# EAGLE design SparkFun_Mic-Preamp-v12 (EAGLE 7.2.0)
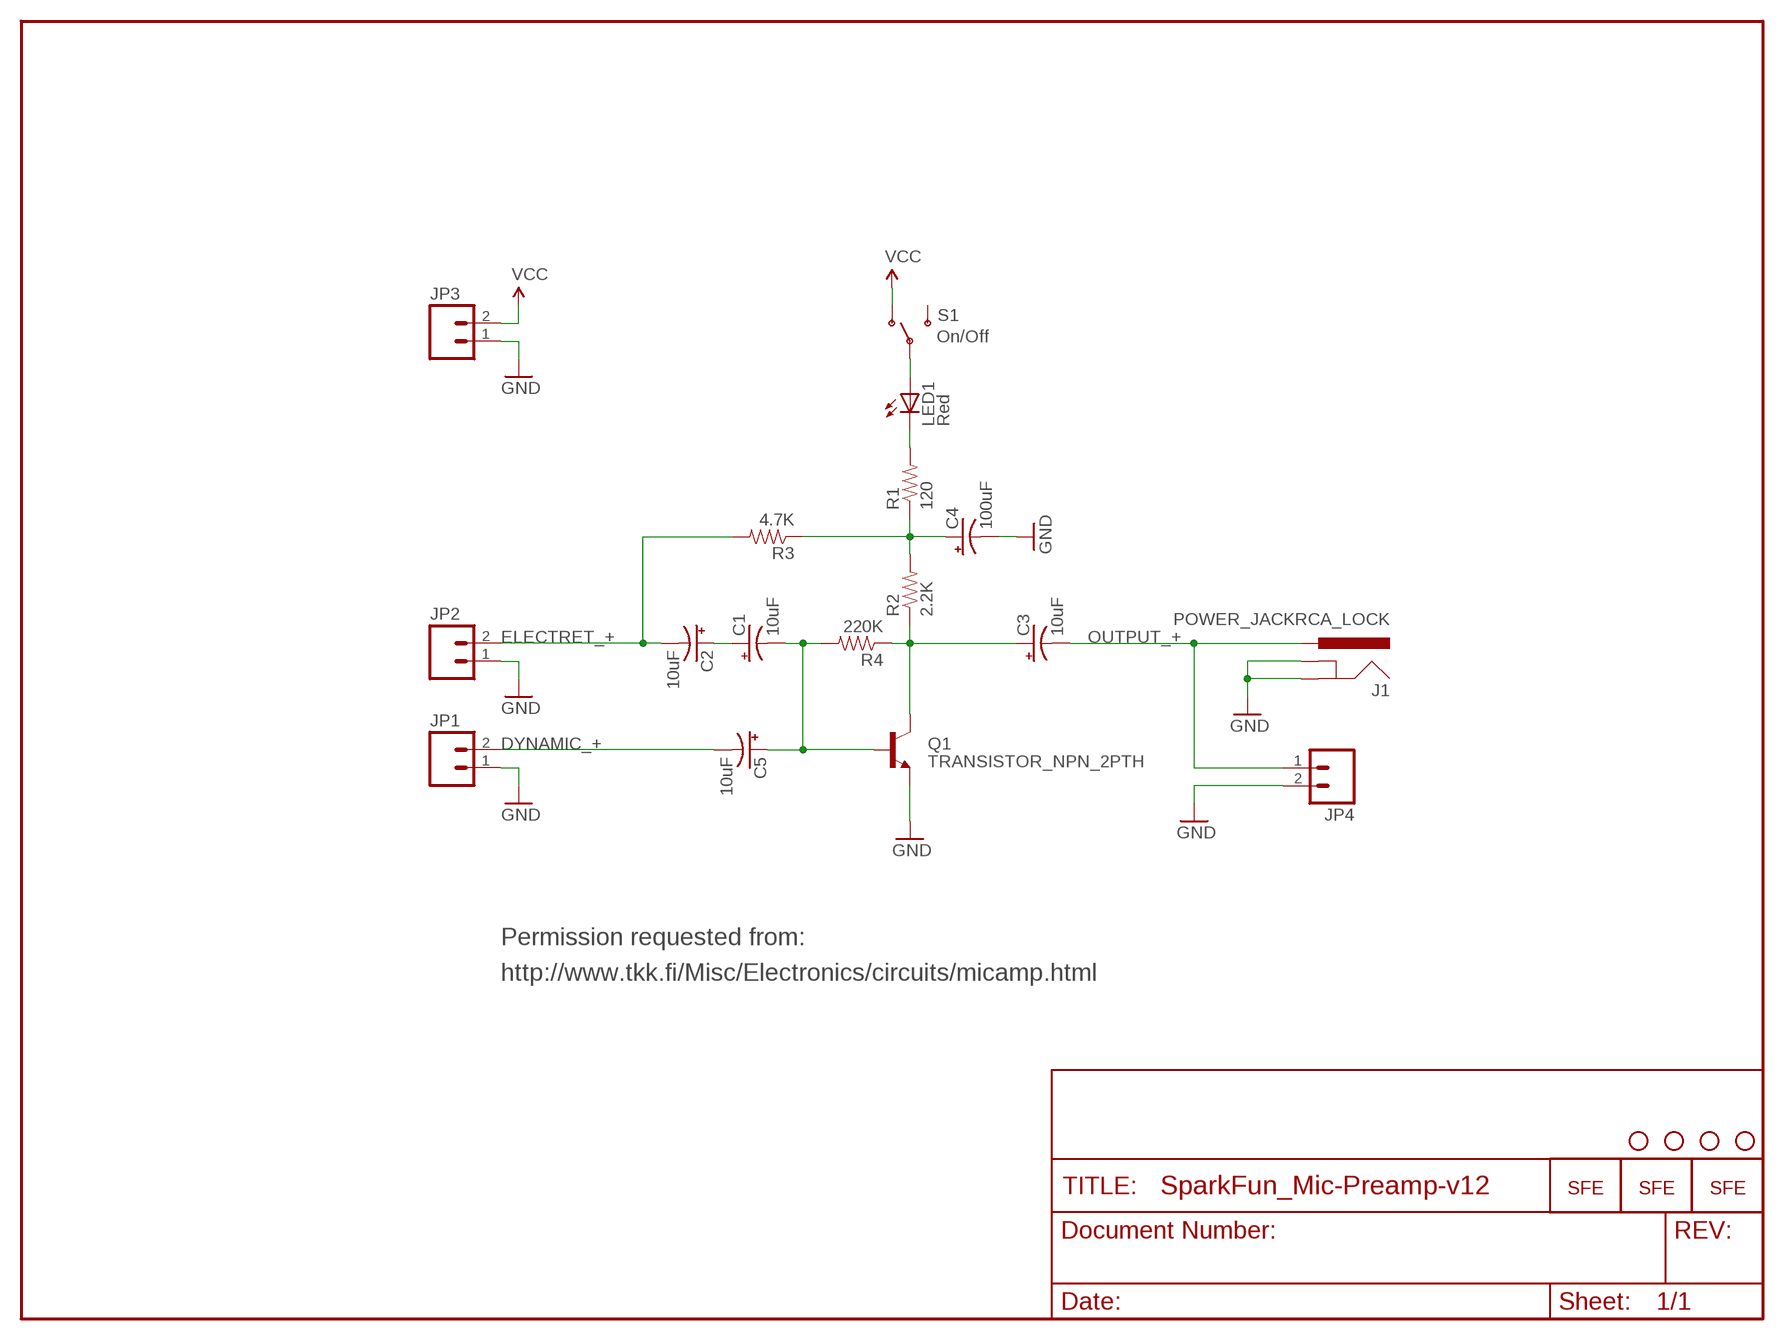
[diagram p0: schematic, sheet 1]

## Parts
C1  10uF  CAP_POLPTH2  [CPOL-RADIAL-10UF-25V]
C2  10uF  CAP_POLPTH2  [CPOL-RADIAL-10UF-25V]
C3  10uF  CAP_POLPTH2  [CPOL-RADIAL-10UF-25V]
C4  100uF  CAP_POLPTH1  [CPOL-RADIAL-100UF-25V]
C5  10uF  CAP_POLPTH2  [CPOL-RADIAL-10UF-25V]
J1  POWER_JACKRCA_LOCK  [RCA_LOCK]
JP1  M02PTH  [1X02]
JP2  M02PTH  [1X02]
JP3  M02PTH  [1X02]
JP4  M02PTH  [1X02]
JP6  LOGO-SFENW2  [SFE-NEW-WEB]
LED1  Red  LED5MM  [LED5MM]
Q1  TRANSISTOR_NPN_2PTH  [TO-92]
R1  120  RESISTORPTH1  [AXIAL-0.3]
R2  2.2K  RESISTORPTH1  [AXIAL-0.3]
R3  4.7K  RESISTORPTH1  [AXIAL-0.3]
R4  220K  RESISTORPTH1  [AXIAL-0.3]
S1  On/Off  SWITCH-SPSTPTH_LOCK  [SWITCH-SPDT_LOCK.007S]
U$1  LOGO-SFESK  [SFE-LOGO-FLAME]
U$2  STAND-OFF  [STAND-OFF]
U$3  STAND-OFF  [STAND-OFF]
U$4  STAND-OFF  [STAND-OFF]
U$5  STAND-OFF  [STAND-OFF]
U$6  LOGO-SFESK  [SFE-LOGO-FLAME]

## Nets
DYNAMIC_+: C5.2(-) JP1.2
ELECTRET_+: C2.2(-) JP2.2 R3.P$2
GND: C4.2(-) J1.BARREL(GND) J1.SPRING(GNDBREAK) JP1.1 JP2.1 JP3.1 JP4.2 Q1.3(E)
N$1: LED1.K(C) R1.P$2
N$2: C3.1(+) Q1.1(C) R2.P$1 R4.P$1
N$3: C4.1(+) R1.P$1 R2.P$2 R3.P$1
N$4: C1.2(-) C5.1(+) Q1.2(B) R4.P$2
N$5: C1.1(+) C2.1(+)
N$6: LED1.A S1.2(P)
OUTPUT_+: C3.2(-) J1.BREAK(PWR) JP4.1
VCC: JP3.2 S1.1(O)
Unconnected: S1.3(S)

## Notes on the sheet
- Permission requested from:
- http://www.tkk.fi/Misc/Electronics/circuits/micamp.html

## Library data of the parts
C1-C5 = SparkFun:CAP_POL: Capacitor Polarized These are standard SMD and PTH capacitors. Normally 10uF, 47uF, and 100uF in electrolytic and tantalum varieties. Always verify the external diameter of the through hole cap, it varies with capacity, voltage, and manufacturer. The EIA devices should be standard.
J1 = SparkFun:POWER_JACK: Power Jack This is the standard 5.5mm barrel jack for power. The PTH is the most common, proven, reliable, footprint. All others are experimental. The Slot footprint only works if the mill layer is transmitted to the PCB fab house so be warned. Spark Fun Electronics SKU : PRT-00119. Mating wall wart : TOL-00298 (and others)
JP1-JP4 = SparkFun:M02: Header 2 Standard 2-pin 0.1" header. Use with straight break away headers (SKU : PRT-00116), right angle break away headers (PRT-00553), swiss pins (PRT-00743), machine pins (PRT-00117), and female headers (PRT-00115). Molex polarized connector foot print use with SKU : PRT-08233 with associated crimp pins and housings.
JP6 U$1 U$6 = SparkFun:LOGO-SFE: Spark Fun Electronics PCB Logo This is the standard Spark Fun Electronics PCB logo.
LED1 = SparkFun:LED: LEDs Standard schematic elements and footprints for 5mm, 3mm, 1206, and 0603 sized LEDs. 5mm - Spark Fun Electronics SKU : COM-00529 (and others)
Q1 = SparkFun:TRANSISTOR_NPN_2
R1-R4 = SparkFun:RESISTOR: Resistor Basic schematic elements and footprints for 0603, 1206, and PTH 1/10th watt (small) resistors.
S1 = SparkFun:SWITCH-SPST: SPST Switch Simple slide switch. Spark Fun Electronics SKU : COM-00102
U$2-U$5 = SparkFun:STAND-OFF: Stand Off This is the mechanical footprint for a #4 phillips button head screw. Use the keepout ring to avoid running the screw head into surrounding components. SKU : PRT-00447

## Board
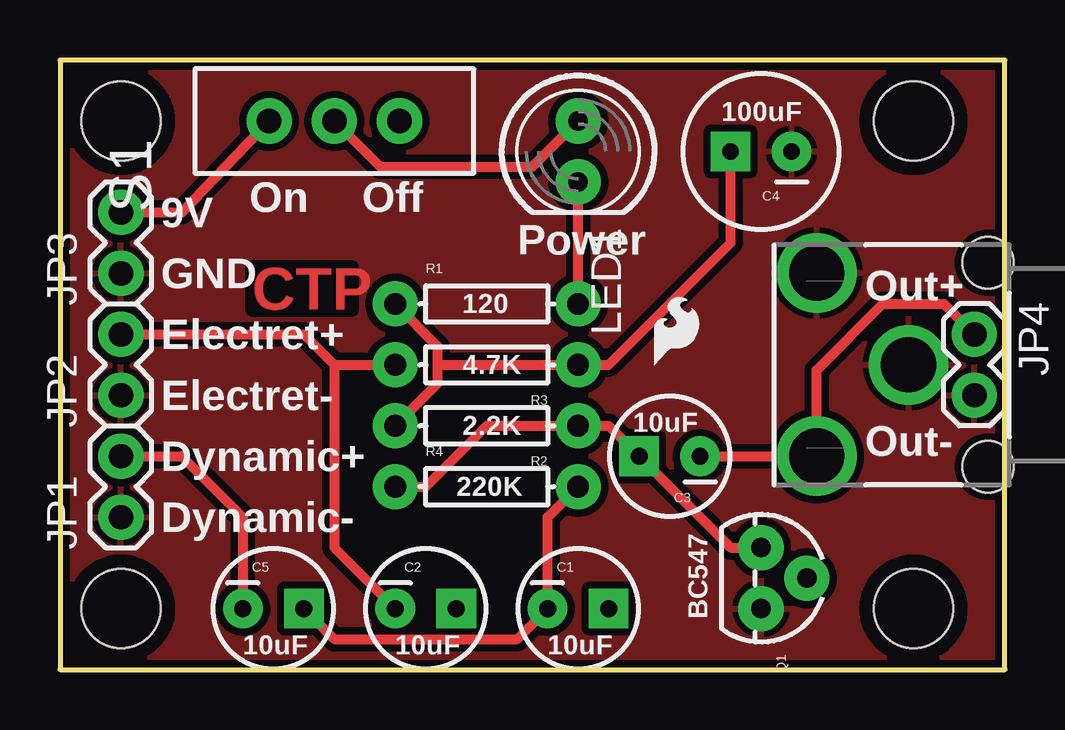
[diagram p1: board, top side]
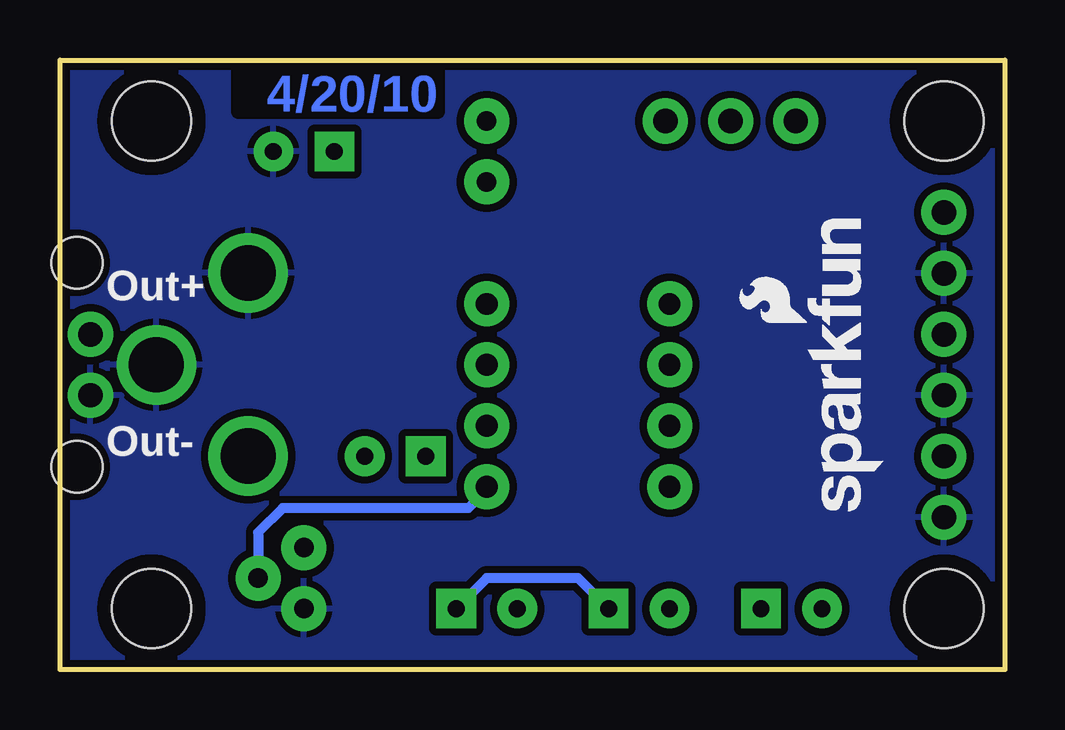
[diagram p2: board, bottom side, seen from below]

Size 39.37 x 25.4 mm. Coordinates in mm from the lower left corner, seen from the top.
Outline: 0,0 39.37,0 39.37,25.4 0,25.4 0,0
Copper layers (1*16): Top 0.035mm / dielectric 1.5mm / Bottom 0.035mm
Design rules "SparkFun": minimum track width 8mil, minimum drill 20mil, track to track 8mil, track to pad 8mil, pad to pad 8mil, via to via 8mil, smd to smd 8mil, copper to edge 8mil, drill to drill 8mil, minimum pad ring 12mil, minimum via ring 10mil, stop-mask expansion 4mil, vias tented up to drill 20mil, thermal gap 10mil

### Footprints (pad centres in the part's own frame; a part is rotated, then mirrored left to right if it is on the bottom)
CPOL-RADIAL-10UF-25V = drill 0.7 pad 1.651 square: 1 1.27,0 | drill 0.7 pad 1.651: 2 -1.27,0
CPOL-RADIAL-100UF-25V = drill 0.7 pad 1.651 square: 1 1.27,0 | drill 0.7 pad 1.651: 2 -1.27,0
RCA_LOCK = drill 2.3: BARREL 0.203,0; BREAK 4.03,3.802; SPRING 4.03,-3.827 | hole 2.134: -3.1,4.25; -3.1,-4.25
1X02 = drill 1.016 pad 1.88: 1 0,0; 2 2.54,0
LED5MM = drill 0.813 pad 1.88: A -1.27,0; K 1.27,0
TO-92 = drill 0.813 pad 1.88: 1 -1.27,0; 2 0,1.905; 3 1.27,0
AXIAL-0.3 = drill 0.9 pad 1.88: P$1 -3.81,0; P$2 3.81,0
SWITCH-SPDT_LOCK.007S = drill 1.016 pad 1.88: 1 0,2.718; 2 0,0; 3 0,-2.718
STAND-OFF = hole 3.302: 0,0

### Placement (x,y rotation side)
C1  21.59,2.54 0 top
C2  15.24,2.54 0 top
C3  25.4,8.89 180 top
C4  29.21,21.59 180 top
C5  8.89,2.54 0 top
J1  35.56,12.7 180 top
JP1  2.54,6.35 90 top
JP2  2.54,11.43 90 top
JP3  2.54,16.51 90 top
JP4  38.1,13.97 270 top
JP6  5.08,6.6 90 bottom
LED1  21.59,21.59 270 top
Q1  29.21,3.81 270 top
R1  17.78,15.24 0 top
R2  17.78,10.16 180 top
R3  17.78,12.7 180 top
R4  17.78,7.62 0 top
S1  11.43,22.86 90 top
U$1  24.77,12.7 0 top
U$2  2.54,2.54 90 top
U$3  2.54,22.86 90 top
U$4  35.56,22.86 90 top
U$5  35.56,2.54 90 top
U$6  8.26,14.48 90 bottom

### Tracks (layer width: path | path; a pad name or v marks a point on that pad's centre or on a via)
DYNAMIC_+
  Top 0.406: JP1.2 5.08,8.89 7.62,6.35 C5.2
ELECTRET_+
  Top 0.406: JP2.2 10.16,13.97 11.43,12.7 | 11.43,12.7 R3.P$2 | C2.2 11.43,5.08 11.43,12.7
GND
  pour Bottom (isolate 0.305): 0,0 0,25.4 39.37,25.4 39.37,0
  pour Top (isolate 0.305): 0,0 0,25.4 39.37,25.4 39.37,0
N$1
  Top 0.406: R1.P$2 LED1.K
N$2
  Top 0.406: R4.P$1 15.24,7.62 17.78,10.16 R2.P$1 22.86,10.16 C3.1 27.94,5.08 Q1.1
N$3
  Top 0.406: R1.P$1 15.75,13.46 15.75,12.7 | 15.75,12.7 15.75,11.94 R2.P$2 | 15.75,12.7 R3.P$1 22.86,12.7 27.94,17.78 C4.1
N$4
  Top 0.406: C5.1 11.43,1.27 19.05,1.27 C1.2 20.32,3.81 20.32,6.35 R4.P$2
  Bottom 0.406: Q1.2 31.11,5.71 30.1,6.73 22.35,6.73 21.59,7.49 R4.P$2
N$5
  Bottom 0.406: C1.1 21.59,3.81 17.78,3.81 C2.1
N$6
  Top 0.406: S1.2 13.34,20.95 19.68,20.95 LED1.A
OUTPUT_+
  Top 0.406: C3.2 30.23,8.89 30.23,8.9 J1.BREAK 31.53,12.48 34.29,15.24 36.83,15.24 JP4.1
VCC
  Top 0.406: JP3.2 5.08,19.05 S1.1

### Text on the board
Top: CTP
Bottom: 4/20/10
tPlace: On | Off | 9V | Power | GND | Out+ | Electret+ | Electret- | Out- | Dynamic+ | Dynamic- | BC547
bPlace: Out+ | Out-
tValues: DNP | Mic on opposite side | Mic Breakout v1.0